# EAGLE design x-OSC Gloves_v3 (EAGLE 6.4)
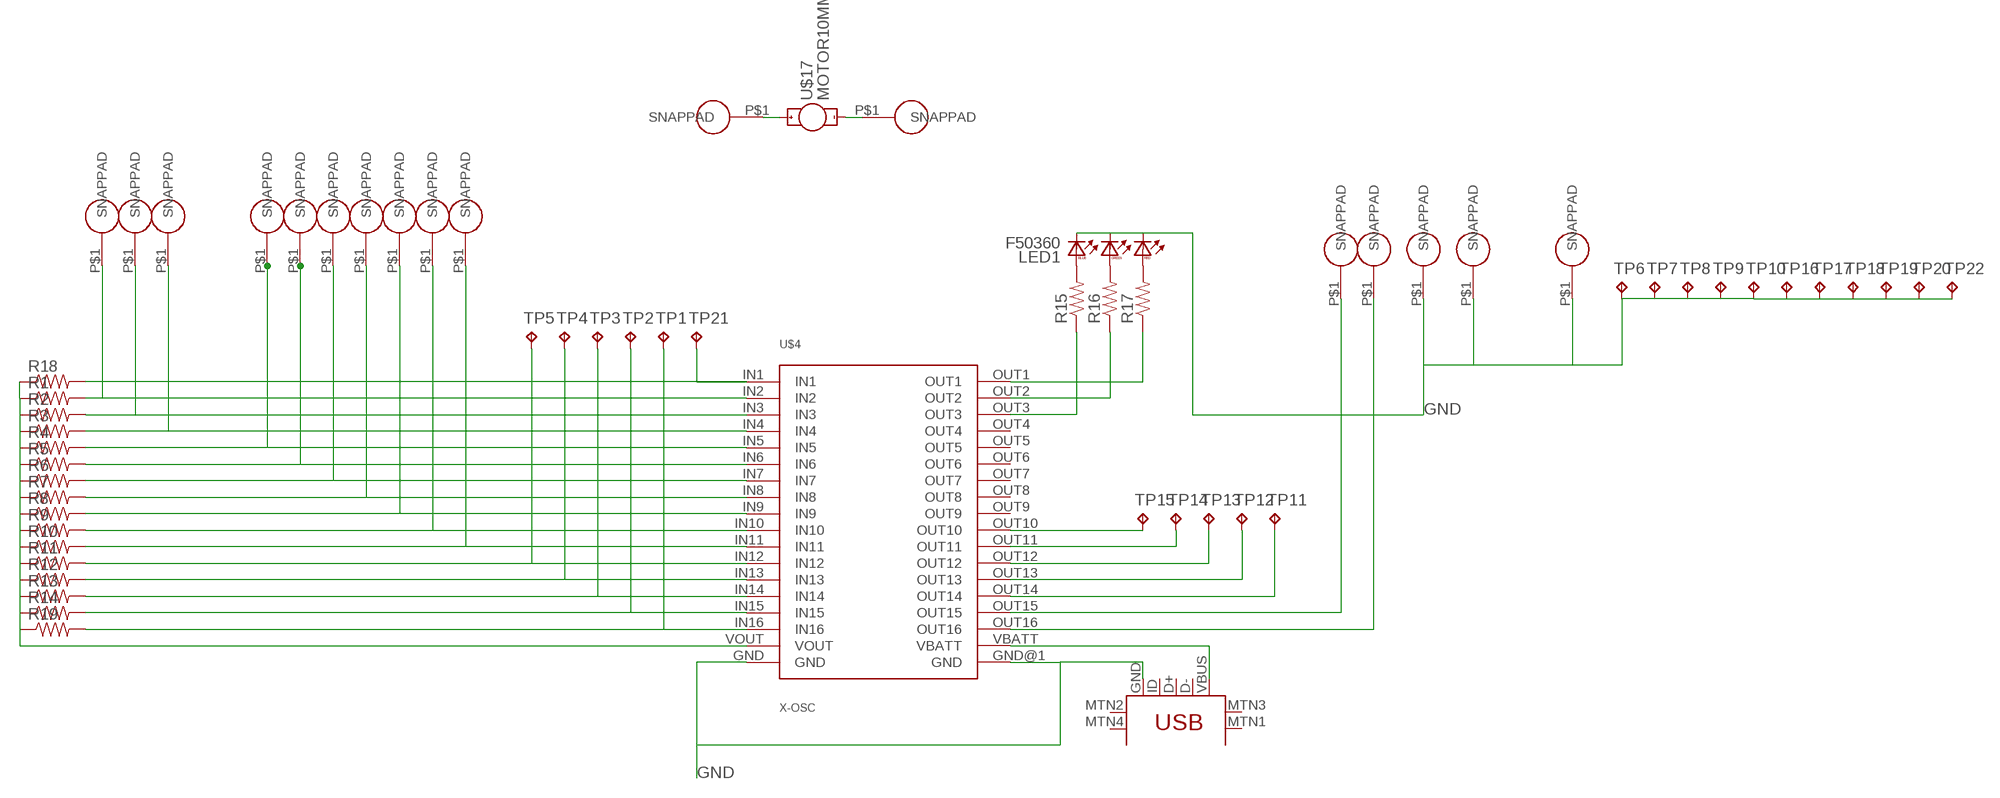
[diagram p0: schematic, sheet 1]

## Parts
LED1  F50360  [F50360]
R1  RESISTOR0805-RES  [0805]
R2  RESISTOR0805-RES  [0805]
R3  RESISTOR0805-RES  [0805]
R4  RESISTOR0805-RES  [0805]
R5  RESISTOR0805-RES  [0805]
R6  RESISTOR0805-RES  [0805]
R7  RESISTOR0805-RES  [0805]
R8  RESISTOR0805-RES  [0805]
R9  RESISTOR0805-RES  [0805]
R10  RESISTOR0805-RES  [0805]
R11  RESISTOR0805-RES  [0805]
R12  RESISTOR0805-RES  [0805]
R13  RESISTOR0805-RES  [0805]
R14  RESISTOR0805-RES  [0805]
R15  RESISTOR0805-RES  [0805]
R16  RESISTOR0805-RES  [0805]
R17  RESISTOR0805-RES  [0805]
R18  RESISTOR0805-RES  [0805]
R19  RESISTOR0805-RES  [0805]
TP1  TPTP20R  [TP20R]
TP2  TPTP20R  [TP20R]
TP3  TPTP20R  [TP20R]
TP4  TPTP20R  [TP20R]
TP5  TPTP20R  [TP20R]
TP6  TPTP20R  [TP20R]
TP7  TPTP20R  [TP20R]
TP8  TPTP20R  [TP20R]
TP9  TPTP20R  [TP20R]
TP10  TPTP20R  [TP20R]
TP11  TPTP20R  [TP20R]
TP12  TPTP20R  [TP20R]
TP13  TPTP20R  [TP20R]
TP14  TPTP20R  [TP20R]
TP15  TPTP20R  [TP20R]
TP16  TPTP20R  [TP20R]
TP17  TPTP20R  [TP20R]
TP18  TPTP20R  [TP20R]
TP19  TPTP20R  [TP20R]
TP20  TPTP20R  [TP20R]
TP21  TPTP20R  [TP20R]
TP22  TPTP20R  [TP20R]
U$1  SNAP-PAD_7MM_ROUND  [SNAP-PAD_7MM_RD]
U$2  SNAP-PAD_7MM_ROUND  [SNAP-PAD_7MM_RD]
U$3  SNAP-PAD_7MM_ROUND  [SNAP-PAD_7MM_RD]
U$4  X-OSC  [X-OSC_SMD]
U$5  USB-MINIB-5PIN  [USB-MINIB]
U$6  SNAP-PAD_7MM_ROUND  [SNAP-PAD_7MM_RD]
U$7  SNAP-PAD_7MM_ROUND  [SNAP-PAD_7MM_RD]
U$8  SNAP-PAD_7MM_ROUND  [SNAP-PAD_7MM_RD]
U$9  SNAP-PAD_7MM_ROUND  [SNAP-PAD_7MM_RD]
U$10  SNAP-PAD_7MM_ROUND  [SNAP-PAD_7MM_RD]
U$11  SNAP-PAD_7MM_ROUND  [SNAP-PAD_7MM_RD]
U$12  SNAP-PAD_7MM_ROUND  [SNAP-PAD_7MM_RD]
U$13  SNAP-PAD_7MM_ROUND  [SNAP-PAD_7MM_RD]
U$14  SNAP-PAD_7MM_ROUND  [SNAP-PAD_7MM_RD]
U$15  SNAP-PAD_7MM_ROUND  [SNAP-PAD_7MM_RD]
U$16  SNAP-PAD_7MM_ROUND  [SNAP-PAD_7MM_RD]
U$17  MOTOR10MM  [VIBE-MOTOR-10MM]
U$18  SNAP-PAD_7MM_ROUND  [SNAP-PAD_7MM_RD]
U$19  SNAP-PAD_7MM_ROUND  [SNAP-PAD_7MM_RD]
U$20  SNAP-PAD_7MM_ROUND  [SNAP-PAD_7MM_RD]

## Nets
GND: LED1.BC LED1.GC LED1.RC TP6.TP TP7.TP TP8.TP TP9.TP TP10.TP TP16.TP TP17.TP TP18.TP TP19.TP TP20.TP TP22.TP U$4.GND U$4.GND@1(GND) U$5.GND U$15.P$1(SNAPPAD) U$16.P$1(SNAPPAD) U$18.P$1(SNAPPAD)
N$1: LED1.BA R15.2
N$2: LED1.GA R16.2
N$3: R15.1 U$4.OUT3
N$4: R1.2 U$1.P$1(SNAPPAD) U$4.IN2
N$5: R16.1 U$4.OUT2
N$6: R2.2 U$2.P$1(SNAPPAD) U$4.IN3
N$7: R3.2 U$3.P$1(SNAPPAD) U$4.IN4
N$8: R4.2 U$4.IN5 U$6.P$1(SNAPPAD)
N$9: R5.2 U$4.IN6 U$7.P$1(SNAPPAD)
N$12: R6.2 U$4.IN7 U$8.P$1(SNAPPAD)
N$13: R7.2 U$4.IN8 U$9.P$1(SNAPPAD)
N$14: R8.2 U$4.IN9 U$10.P$1(SNAPPAD)
N$15: R9.2 U$4.IN10 U$11.P$1(SNAPPAD)
N$16: R10.2 U$4.IN11 U$12.P$1(SNAPPAD)
N$17: LED1.RA R17.2
N$18: R11.2 TP5.TP U$4.IN12
N$19: R12.2 TP4.TP U$4.IN13
N$20: R13.2 TP3.TP U$4.IN14
N$21: R14.2 TP2.TP U$4.IN15
N$22: R19.2 TP1.TP U$4.IN16
N$23: U$4.OUT15 U$13.P$1(SNAPPAD)
N$24: U$4.OUT16 U$14.P$1(SNAPPAD)
N$25: R17.1 U$4.OUT1
N$26: TP11.TP U$4.OUT14
N$29: TP12.TP U$4.OUT13
N$30: TP13.TP U$4.OUT12
N$31: TP14.TP U$4.OUT11
N$32: TP15.TP U$4.OUT10
N$33: U$4.VBATT U$5.VBUS
N$38: U$17.+ U$19.P$1(SNAPPAD)
N$40: R18.2 TP21.TP U$4.IN1
N$46: U$17.- U$20.P$1(SNAPPAD)
VDD: R1.1 R2.1 R3.1 R4.1 R5.1 R6.1 R7.1 R8.1 R9.1 R10.1 R11.1 R12.1 R13.1 R14.1 R18.1 R19.1 U$4.VOUT
Unconnected: U$4.OUT4 U$4.OUT5 U$4.OUT6 U$4.OUT7 U$4.OUT8 U$4.OUT9 U$5.D+ U$5.D- U$5.ID U$5.MTN1(MTN2) U$5.MTN2(MTN3) U$5.MTN3(MTN1) U$5.MTN4

## Library data of the parts
LED1 = led:F50360: Full color Z-Power LED RGB P5-II Series Source: http://www.seoulsemicon.co.kr .. F50360.pdf
R1-R19 = SparkFun-Passives:RESISTOR: Resistor Basic schematic elements and footprints for 0603, 1206, and PTH resistors.
TP1-TP22 = testpad:TP: Test pad
U$1-U$3 U$6-U$16 U$18-U$20 = hannahsEagleLib:SNAP-PAD_7MM_ROUND
U$4 = x-io:X-OSC: 2x "TSM-118-04-F-SV" See: http://www.toby.co.uk/content/catalogue/products.aspx?series=TSM-1xx-xx-SV
U$5 = SparkFun-Connectors:USB-MINIB: Mini-USB "B" connector with 5th pin broken out. Created new symbol breaking out 5th "ID" pin in mini/micro USB connector spec. See: http://en.wikipedia.org/wiki/Mini_usb#Cables. Uses same footprint as 4-pin symbol. Also added pins to connect to mounting / shield pads if required (probably not generally needed as signals aren't shielded once they leave the connector).
U$17 = SparkFun-Electromechanical:MOTOR: Vibration Motor- ROB-08449 Physical dimension and wire connections for this powerful vibration motor. Motor has a self adhesive backing.

## Board
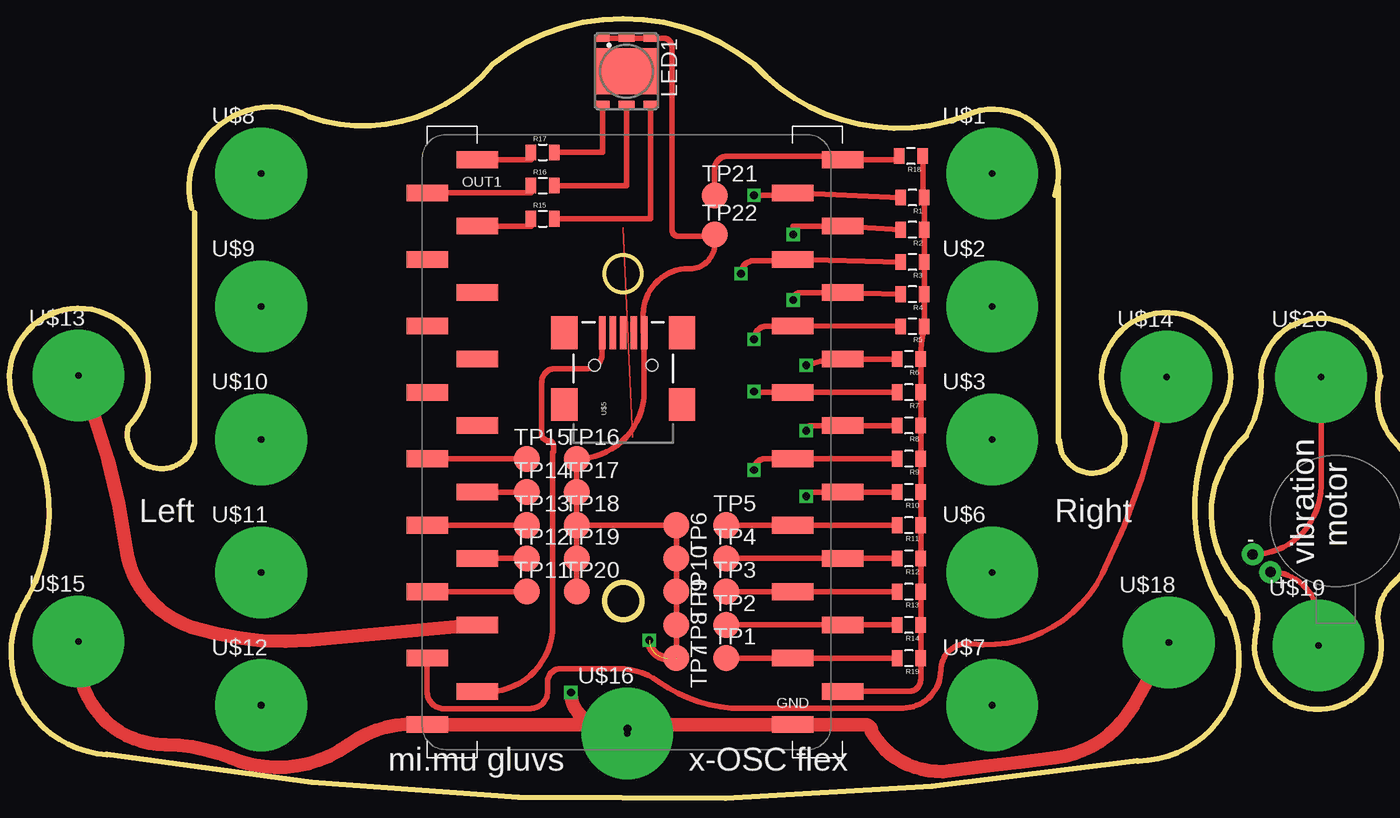
[diagram p1: board, top side]
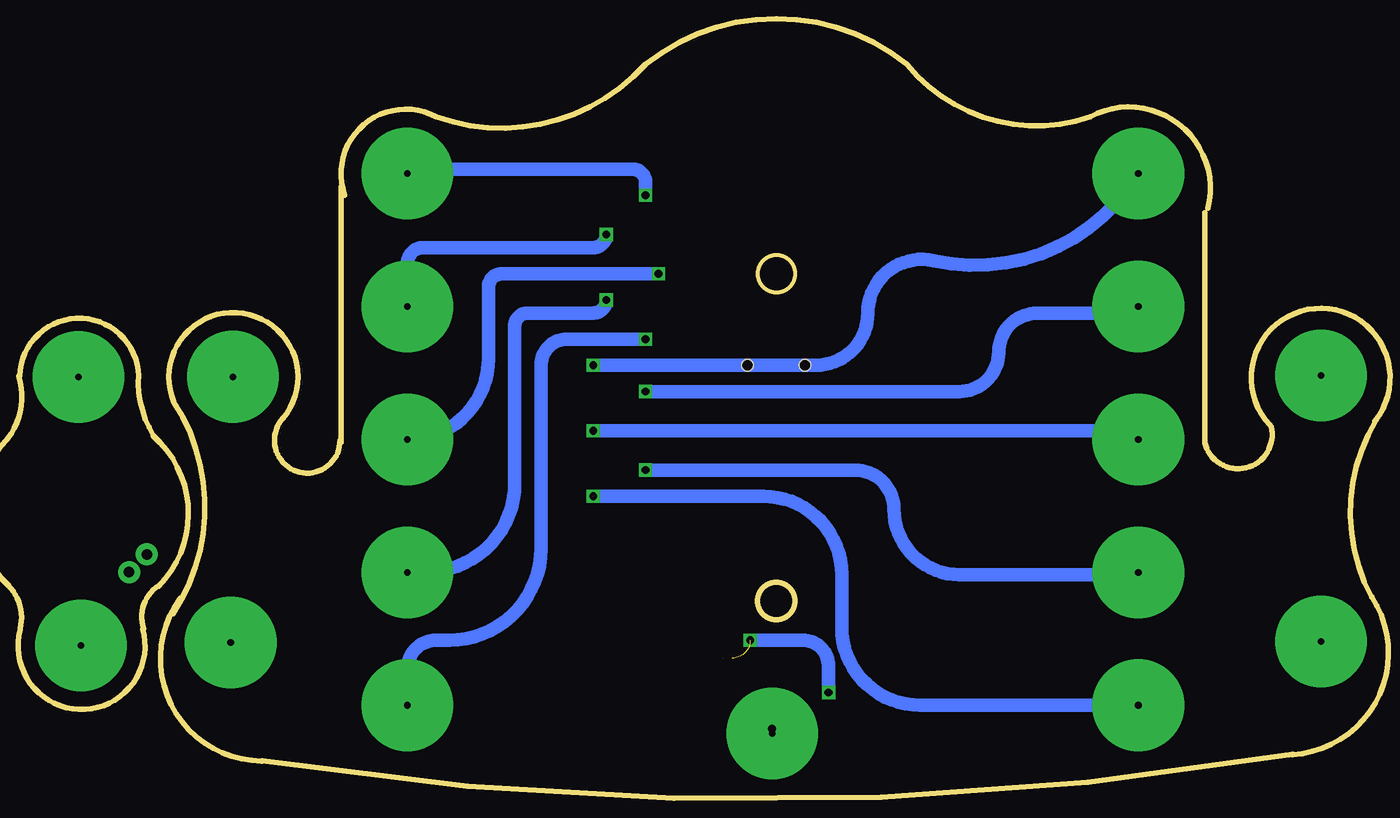
[diagram p2: board, bottom side, seen from below]

No outline drawn. Coordinates in mm, seen from the top.
Copper layers (1*16): Top 0.035mm / dielectric 1.5mm / Bottom 0.035mm
Design rules "default": minimum track width 10mil, minimum drill 24mil, track to track 8mil, track to pad 8mil, pad to pad 8mil, via to via 8mil, smd to smd 8mil, copper to edge 40mil, drill to drill 8mil, minimum pad ring 10mil, minimum via ring 8mil, stop-mask expansion 4mil, vias tented up to drill 0mil, thermal gap 10mil
Milling: area 46.6,10.6 to 49.4,13.4; area 46.6,35.6 to 49.4,38.4; 24 lines

### Footprints (pad centres in the part's own frame; a part is rotated, then mirrored left to right if it is on the bottom)
F50360 = smd 0.6 x 1.05: BA 2.55,1.825; BC -2.55,1.825; RA 2.55,-1.825; RC -2.55,-1.825 | smd 0.6 x 1.2: GA 2.55,0; GC -2.55,0 | smd 3.5 x 4.7: NC 0,0
0805 = smd 0.8 x 1.2: 1 -0.9,0; 2 0.9,0
TP20R = smd 2 x 2: TP 0,0
SNAP-PAD_7MM_RD = drill 0.5 pad 7: P$1 0,0
X-OSC_SMD = smd 3.17 x 1.27: GND 12.7,-21.59; GND@1 -15.24,-21.59; IN1 16.51,21.59; IN2 12.7,19.05; IN3 16.51,16.51; IN4 12.7,13.97; IN5 16.51,11.43; IN6 12.7,8.89; IN7 16.51,6.35; IN8 12.7,3.81; IN9 16.51,1.27; IN10 12.7,-1.27; IN11 16.51,-3.81; IN12 12.7,-6.35; IN13 16.51,-8.89; IN14 12.7,-11.43; IN15 16.51,-13.97; IN16 12.7,-16.51; OUT1 -11.43,21.59; OUT2 -15.24,19.05; OUT3 -11.43,16.51; OUT4 -15.24,13.97; OUT5 -11.43,11.43; OUT6 -15.24,8.89; OUT7 -11.43,6.35; OUT8 -15.24,3.81; OUT9 -11.43,1.27; OUT10 -15.24,-1.27; OUT11 -11.43,-3.81; OUT12 -15.24,-6.35; OUT13 -11.43,-8.89; OUT14 -15.24,-11.43; OUT15 -11.43,-13.97; OUT16 -15.24,-16.51; VBATT -11.43,-19.05; VOUT 16.51,-19.05
USB-MINIB = smd 2.5 x 0.5: D+ 2.5,0; D- 2.5,0.8; GND 2.5,-1.6; ID 2.5,-0.8; VBUS 2.5,1.6 | smd 2.5 x 2: MTN1 -3,4.5; MTN2 2.5,4.5; MTN3 -3,-4.5; MTN4 2.5,-4.5 | hole 0.9: 0,2.2; 0,-2.2
VIBE-MOTOR-10MM = drill 0.8 pad 1.676: + -5,-3.9; - -6.35,-2.54

### Placement (x,y rotation side)
LED1  48.26,52.47 270 top
R1  70.12,42.82 180 top
R2  70.12,40.36 180 top
R3  70.12,37.9 180 top
R4  70.12,35.44 180 top
R5  70.12,32.98 180 top
R6  69.85,30.48 180 top
R7  69.85,27.94 180 top
R8  69.85,25.4 180 top
R9  69.85,22.86 180 top
R10  69.85,20.32 180 top
R11  69.85,17.78 180 top
R12  69.85,15.24 180 top
R13  69.85,12.7 180 top
R14  69.85,10.16 180 top
R15  41.85,41.2 0 top
R16  41.85,43.74 0 top
R17  41.85,46.28 0 top
R18  70,46 180 top
R19  69.85,7.62 180 top
TP1  55.88,7.62 0 top
TP2  55.88,10.16 0 top
TP3  55.88,12.7 0 top
TP4  55.88,15.24 0 top
TP5  55.88,17.78 0 top
TP6  52.07,17.78 270 top
TP7  52.07,7.62 270 top
TP8  52.07,10.16 270 top
TP9  52.07,12.7 270 top
TP10  52.07,15.24 270 top
TP11  40.64,12.7 0 top
TP12  40.64,15.24 0 top
TP13  40.64,17.78 0 top
TP14  40.64,20.32 0 top
TP15  40.64,22.86 0 top
TP16  44.45,22.86 0 top
TP17  44.45,20.32 0 top
TP18  44.45,17.78 0 top
TP19  44.45,15.24 0 top
TP20  44.45,12.7 0 top
TP21  55,43 0 top
TP22  55,40 0 top
U$1  76.2,44.66 0 top
U$2  76.2,34.5 0 top
U$3  76.2,24.34 0 top
U$4  48.26,24.13 0 top
U$5  48,30 90 top
U$6  76.2,14.18 0 top
U$7  76.2,4.02 0 top
U$8  20.32,44.66 0 top
U$9  20.32,34.5 0 top
U$10  20.32,24.34 0 top
U$11  20.32,14.18 0 top
U$12  20.32,4.02 0 top
U$13  6.35,29.21 0 top
U$14  89.56,29.13 0 top
U$15  6.35,8.89 0 top
U$16  48.32,1.86 0 top
U$17  102.49,18.1 0 top
U$18  89.72,8.81 0 top
U$19  101.16,8.58 0 top
U$20  101.36,29.12 0 top

### Tracks (layer width: path | path; a pad name or v marks a point on that pad's centre or on a via)
GND  (via drill 0.6)  (3 unrouted)
  Top 0.406: LED1.RC LED1.GC LED1.BC 51.05,55.02 arc-90 51.72,54.34 51.72,40.39 arc90 52.24,39.87 54.87,39.87 arc90 TP22.TP 55,39.29 arc-90 53.1,37.39 53.01,37.39 arc90 49.53,33.91 49.53,32.57 arc90 U$5.GND 49.6,28.01 arc-90 TP16.TP | TP16.TP TP17.TP TP18.TP | TP18.TP TP19.TP TP20.TP | TP16.TP TP18.TP | TP18.TP TP6.TP TP10.TP TP9.TP TP8.TP TP7.TP 51.38,7.62 | v48.32,2.22 arc90 48,2.54
  Top 0.61: 51.38,7.62 arc-90 50,9
  Top 1.016: 46.46,2.54 U$4.GND@1 arc42 27,1 arc-58 18,0 arc23 13,1 arc-90 6.35,7.65 U$15.P$1 | U$16.P$1 v48.32,2.22 | 46.46,2.54 48,2.54 U$4.GND 66.46,2.54 arc-90 67,2 arc68 73,-1 arc0 81,0 arc54 87,4 U$18.P$1 | 46.46,2.54 arc-90 v44,5
  Bottom 1.016: v44,5 44,7 arc-90 46,9 50,9
N$1
  Top 0.406: R15.2 50.09,41.2 LED1.BA
N$2
  Top 0.406: R16.2 48.26,43.74 LED1.GA
N$3
  Top 0.406: U$4.OUT3 40.95,40.64 R15.1
N$4  (via drill 0.6)
  Top 0.406: R1.2 U$4.IN2 60.96,43 v58,43
  Bottom 0.406: 75.86,45 arc-90 U$1.P$1
  Bottom 1.016: v58,43 58,44 arc-90 59,45 75.86,45
N$5
  Top 0.406: U$4.OUT2 40.95,43.18 R16.1
N$6  (via drill 0.6)
  Top 0.406: R2.2 U$4.IN3 61,40.64 v61,40
  Bottom 1.016: U$2.P$1 76.2,37.8 arc90 75,39 62,39 arc-90 v61,40
N$7  (via drill 0.6)
  Top 0.406: R3.2 U$4.IN4 arc-90 60.86,38 58,38 arc90 v57,37
  Bottom 1.016: U$3.P$1 arc-90 70,30.54 70,36 arc90 69,37 v57,37
N$8  (via drill 0.6)
  Top 0.406: R4.2 U$4.IN5 61.56,35.56 arc90 v61,35
  Bottom 1.016: v61,35 arc90 62,34 67,34 arc-90 68,33 68,21 arc90 74.82,14.18 U$6.P$1
N$9  (via drill 0.6)
  Top 0.406: R5.2 U$4.IN6 arc-90 60.94,33 59,33 arc90 v58,32
  Bottom 1.016: U$7.P$1 76.2,6.8 arc90 74,9 73,9 arc-90 66,16 66,30 arc90 64,32 v58,32
N$10  (via drill 0.6)
  other vias: 58,28
N$11  (via drill 0.6)
  other vias: 62,30
N$12  (via drill 0.6)
  Top 0.406: R6.2 U$4.IN7 arc20 v62,30
  Bottom 1.016: v62,30 45,30 arc-90 41,34 arc103 36,38 arc-71 U$8.P$1
N$13  (via drill 0.6)
  Top 0.406: R7.2 U$4.IN8 58.06,27.94 arc-90 v58,28
  Bottom 1.016: v58,28 34,28 arc-90 31,31 arc90 28,34 22,34 arc-33 U$9.P$1
N$14  (via drill 0.6)
  Top 0.406: R8.2 U$4.IN9 62.4,25.4 arc90 v62,25
  Bottom 1.016: v62,25 20.98,25 arc90 U$10.P$1
N$15  (via drill 0.6)
  Top 0.406: R9.2 U$4.IN10 58.86,22.86 arc90 v58,22
  Bottom 1.016: v58,22 42,22 arc90 39,19 arc-90 34,14 20.5,14 arc-90 U$11.P$1
N$16  (1 unrouted)
  Top 0.406: R10.2 U$4.IN11 62.32,20.32 arc90 62,20
  Bottom 1.016: U$12.P$1 37.02,4.02 arc90 43,10 43,14 arc-90 49,20 62,20
N$17
  Top 0.406: R17.2 46.44,46.28 LED1.RA
N$18
  Top 0.406: R11.2 U$4.IN12 TP5.TP
N$19
  Top 0.406: R12.2 U$4.IN13 TP4.TP
N$20
  Top 0.406: R13.2 U$4.IN14 TP3.TP
N$21
  Top 0.406: R14.2 U$4.IN15 TP2.TP
N$22
  Top 0.406: R19.2 U$4.IN16 TP1.TP
N$23
  Top 1.016: U$4.OUT15 24,9 arc-23 15,10 arc-65 10,16 arc16 U$13.P$1
N$24
  Top 0.406: U$4.OUT16 33.01,5.04 arc85 34.16,3.77 40.9,3.77 arc90 42.21,5.08 42.21,5.79 arc-90 43.24,6.82 47.61,6.82 arc-36 50.7,5.83 arc31 56.3,3.81 arc90 56.3,3.81 69.39,3.81 arc90 72.28,6.7 arc-97 74.59,8.73 arc71 84.63,14.06 arc17 U$14.P$1
N$25
  Top 0.406: U$4.OUT1 40.95,45.72 R17.1
N$26
  Top 0.406: TP11.TP U$4.OUT14
N$28  (via drill 0.6)
  other vias: 62,25
N$29
  Top 0.406: TP12.TP U$4.OUT13
N$30
  Top 0.406: TP13.TP U$4.OUT12
N$31
  Top 0.406: TP14.TP U$4.OUT11
N$32
  Top 0.406: TP15.TP U$4.OUT10
N$33
  Top 0.406: U$5.VBUS 46.4,30.89 arc-90 45.27,29.76 42.81,29.76 arc90 41.78,28.73 41.78,25.08 41.78,24.75 arc90 42.28,24.24 arc-90 42.66,23.86 42.66,23.39 arc90 42.61,23.34 42.61,10.12 arc-98 U$4.VBATT
N$34  (via drill 0.6)
  other vias: 58,22
N$35  (via drill 0.6)
  other vias: 62,20
N$36  (via drill 0.6)
  other vias: 50,9
N$37  (via drill 0.6)
  other vias: 44,5
N$38
  Top 0.406: U$17.+ arc-90 101.16,10.53 U$19.P$1
N$40
  Top 0.406: TP21.TP 55,45 arc-90 56,46 64.49,46 arc-90 U$4.IN1 68.82,45.72 arc90 R18.2
N$41  (via drill 0.6)
  other vias: 58,32
N$42  (via drill 0.6)
  other vias: 61,35
N$43  (via drill 0.6)
  other vias: 57,37
N$44  (via drill 0.6)
  other vias: 61,40
N$45  (via drill 0.6)
  other vias: 58,43
N$46
  Top 0.406: U$20.P$1 101.36,20.78 arc-90 U$17.-
VDD
  Top 0.406: U$4.VOUT 69.85,5.08 arc90 70.75,5.98 R19.1 R14.1 R13.1 R12.1 R11.1 R10.1 R9.1 R8.1 R7.1 R6.1 arc-12 R5.1 R4.1 R3.1 R2.1 R1.1 arc-90 70.9,42.94 R18.1
(copper drawn outside any net)
  shapes: Top area x1

### Text on the board
_tsilk: Left | Right | motor | vibration | mi.mu gluvs | x-OSC flex